# EAGLE design Joy2PS2 (EAGLE 7.7.0)
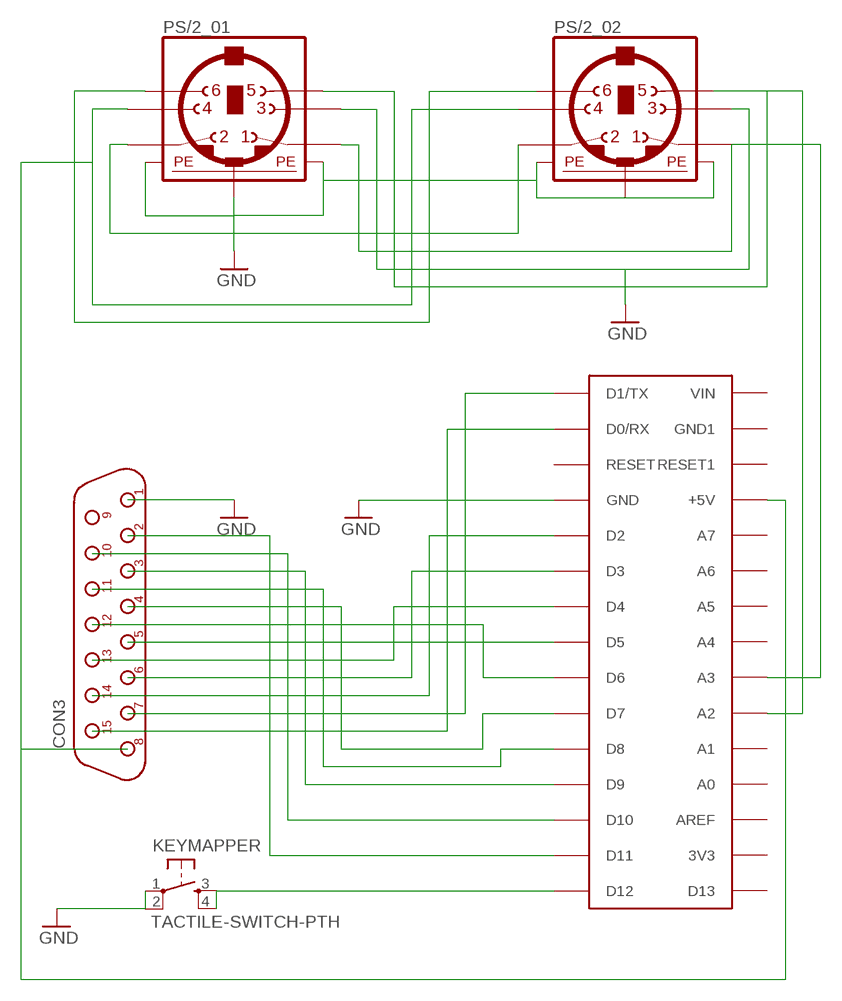
[diagram p0: schematic, sheet 1]

## Parts
ARDUINONANO  ARDUINONANO  [PDIP-32]
CON3  DB15F/90  [D-15F/90]
KEYMAPPER  TACTILE-SWITCH-PTH  [TAC-SWITCH-PTH]
PS/2_01  MINI_DIN_6  [M_DIN6]
PS/2_02  MINI_DIN_6  [M_DIN6]

## Nets
GND: ARDUINONANO.GND CON3.1 KEYMAPPER.1 KEYMAPPER.2 PS/2_01.3 PS/2_01.SH1(PE1) PS/2_01.SH2(PE2) PS/2_01.SH3(PE3) PS/2_02.3 PS/2_02.SH1(PE1) PS/2_02.SH2(PE2) PS/2_02.SH3(PE3)
N$1: ARDUINONANO.A3 PS/2_01.1 PS/2_02.1
N$2: PS/2_01.2 PS/2_02.2
N$3: ARDUINONANO.+5V CON3.8 PS/2_01.4 PS/2_02.4
N$5: ARDUINONANO.A2 PS/2_01.5 PS/2_02.5
N$6: ARDUINONANO.D10 CON3.10
N$7: ARDUINONANO.D8 CON3.11
N$8: ARDUINONANO.D0/RX CON3.15
N$9: ARDUINONANO.D1/TX CON3.7
N$10: ARDUINONANO.D2 CON3.14
N$11: ARDUINONANO.D3 CON3.6
N$12: ARDUINONANO.D4 CON3.13
N$13: ARDUINONANO.D5 CON3.5
N$14: ARDUINONANO.D6 CON3.12
N$15: ARDUINONANO.D7 CON3.4
N$16: ARDUINONANO.D9 CON3.3
N$17: ARDUINONANO.D11 CON3.2
N$19: ARDUINONANO.D12 KEYMAPPER.3 KEYMAPPER.4
N$20: PS/2_01.6 PS/2_02.6
Unconnected: ARDUINONANO.3V3 ARDUINONANO.A0 ARDUINONANO.A1 ARDUINONANO.A4 ARDUINONANO.A5 ARDUINONANO.A6 ARDUINONANO.A7 ARDUINONANO.AREF ARDUINONANO.D13 ARDUINONANO.GND1 ARDUINONANO.RESET ARDUINONANO.RESET1 ARDUINONANO.VIN CON3.9

## Library data of the parts
ARDUINONANO = jet-lib2:ARDUINONANO
CON3 = connect:DB15F/90
KEYMAPPER = GeekAmmo:TACTILE-SWITCH: Tactile Switch 4 Pins, SPST NO
PS/2_01 PS/2_02 = mini_din:MINI_DIN_6

## Board
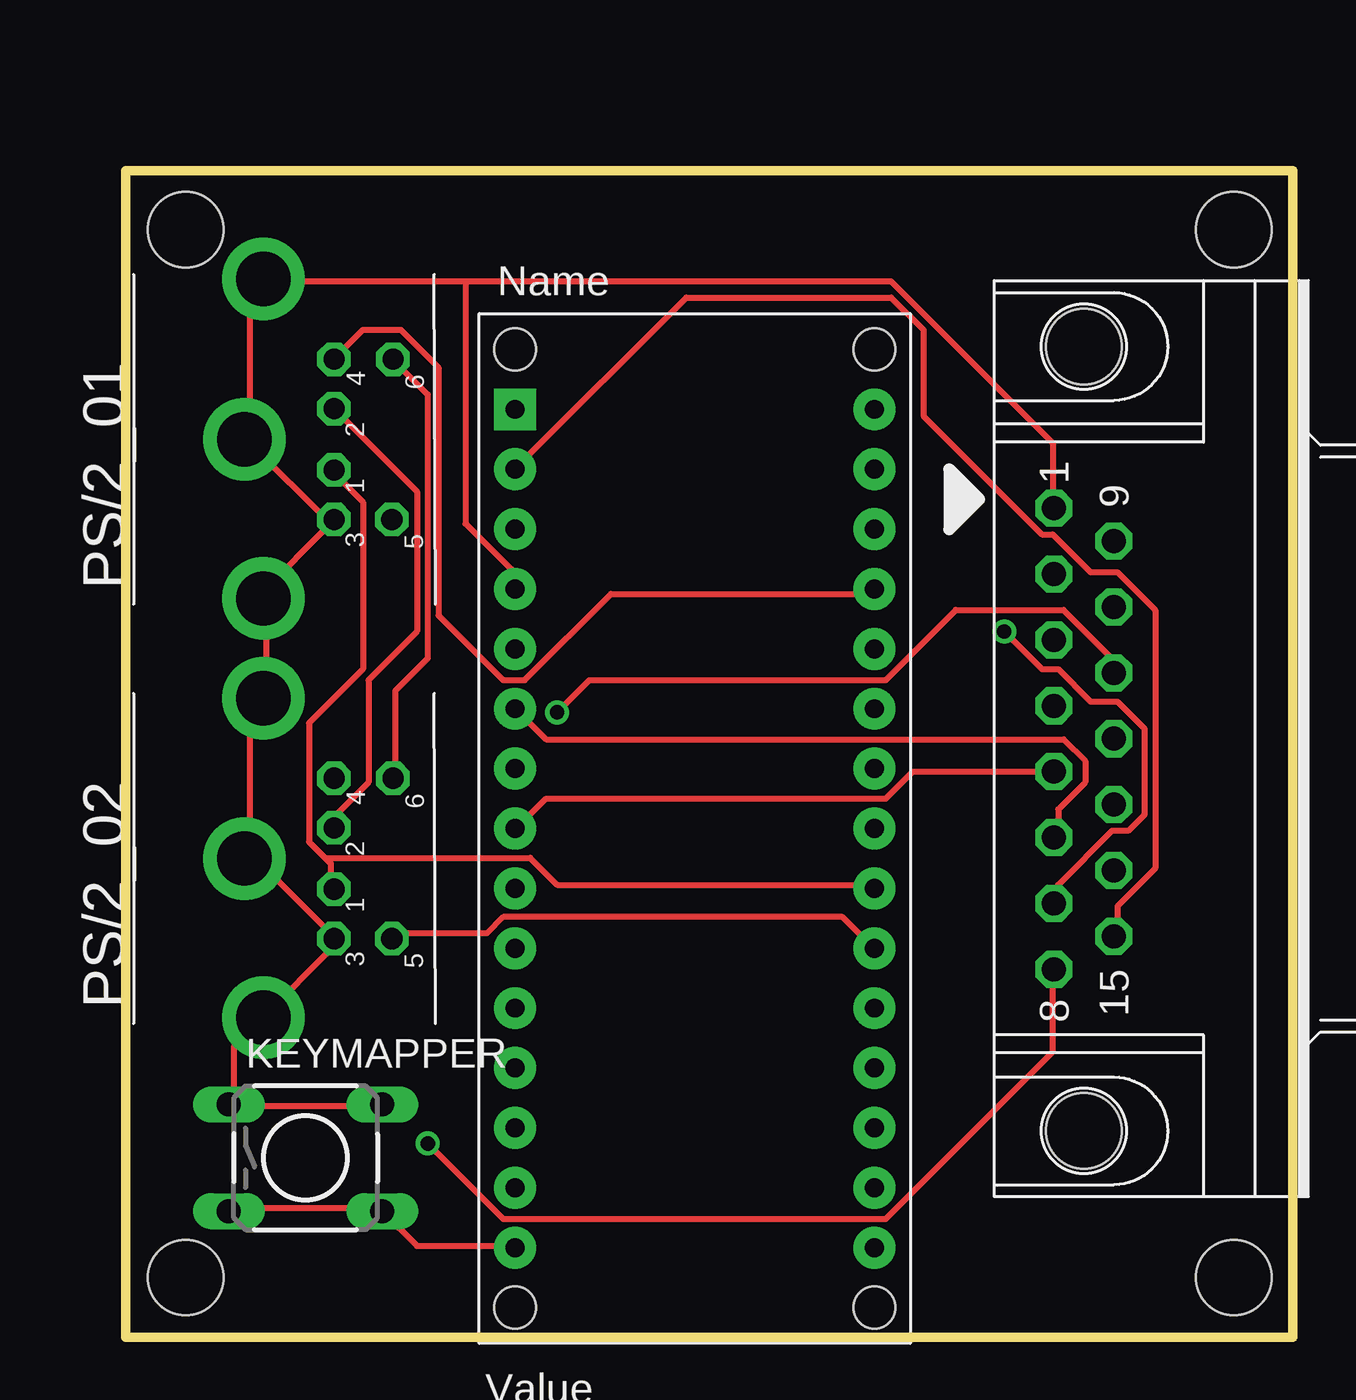
[diagram p1: board, top side]
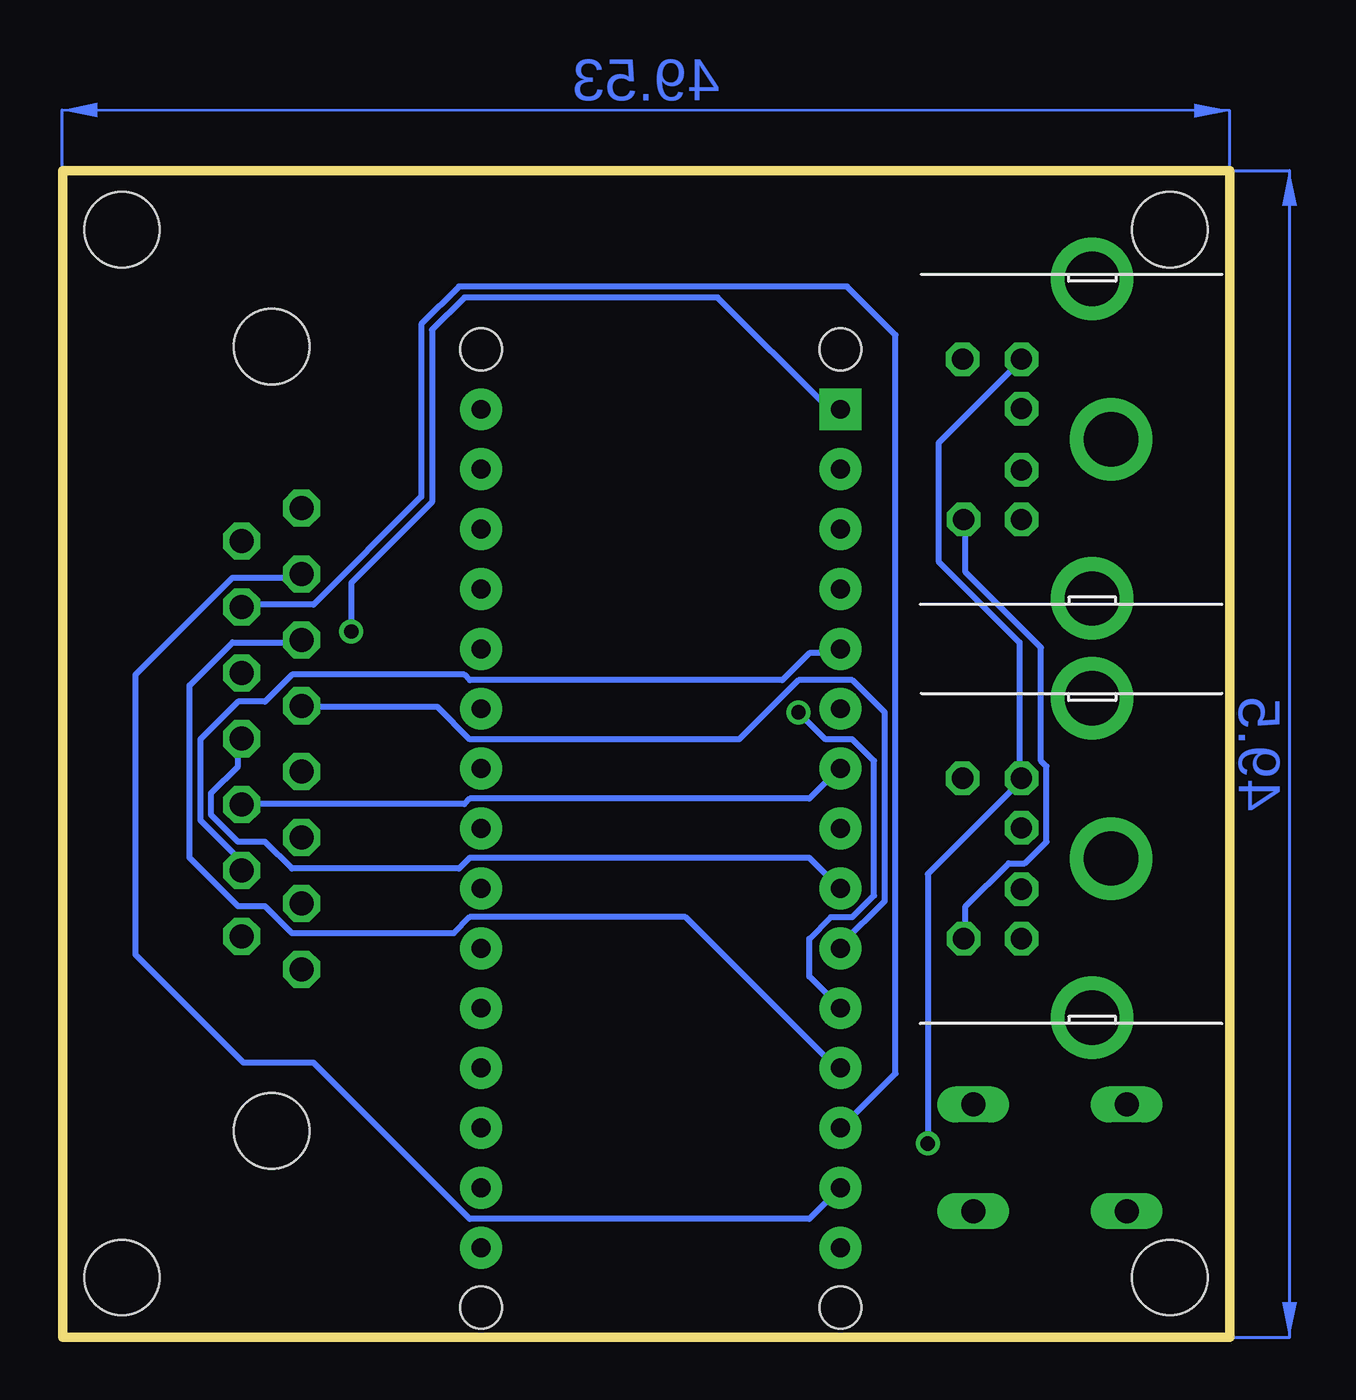
[diagram p2: board, bottom side, seen from below]

Size 49.5 x 49.5 mm. Coordinates in mm from the lower left corner, seen from the top.
Outline: 0,0 49.5,0 49.5,49.5 0,49.5 0,0
Copper layers (1*16): Top 0.035mm / dielectric 1.5mm / Bottom 0.035mm
Design rules "default": minimum track width 10mil, minimum drill 24mil, track to track 8mil, track to pad 8mil, pad to pad 8mil, via to via 8mil, smd to smd 8mil, copper to edge 40mil, drill to drill 8mil, minimum pad ring 10mil, minimum via ring 8mil, stop-mask expansion 4mil, vias tented up to drill 0mil, thermal gap 10mil
Holes 3.2 mm at 46.99,46.99 46.99,2.54 2.54,46.99 2.54,2.54

### Footprints (pad centres in the part's own frame; a part is rotated, then mirrored left to right if it is on the bottom)
PDIP-32 = drill 0.8 pad 1.778: 3V3 15.24,-35.56; +5V 15.24,-10.16; A0 15.24,-30.48; A1 15.24,-27.94; A2 15.24,-25.4; A3 15.24,-22.86; A4 15.24,-20.32; A5 15.24,-17.78; A6 15.24,-15.24; A7 15.24,-12.7; AREF 15.24,-33.02; D0/RX 0,-5.08; D2 0,-12.7; D3 0,-15.24; D4 0,-17.78; D5 0,-20.32; D6 0,-22.86; D7 0,-25.4; D8 0,-27.94; D9 0,-30.48; D10 0,-33.02; D11 0,-35.56; D12 0,-38.1; D13 15.24,-38.1; GND 0,-10.16; GND1 15.24,-5.08; RESET 0,-7.62; RESET1 15.24,-7.62; VIN 15.24,-2.54 | drill 0.8 pad 1.778 square: D1/TX 0,-2.54 | hole 1.778: 0,0; 0,-40.64; 15.24,-40.64; 15.24,0
D-15F/90 = drill 1.016 pad 1.575 octagon: 1 -9.779,-1.27; 2 -6.985,-1.27; 3 -4.191,-1.27; 4 -1.397,-1.27; 5 1.397,-1.27; 6 4.191,-1.27; 7 6.985,-1.27; 8 9.779,-1.27; 9 -8.382,1.27; 10 -5.588,1.27; 11 -2.794,1.27; 12 0,1.27; 13 2.794,1.27; 14 5.588,1.27; 15 8.382,1.27 | hole 3.2: 16.637,0; -16.637,0
TAC-SWITCH-PTH = drill 1.016 pad 1.524 long: 1 -3.251,2.261; 2 3.251,2.261; 3 -3.251,-2.261; 4 3.251,-2.261
M_DIN6 = drill 0.9 pad 1.422 octagon: 1 -1.3,-3.75; 2 1.3,-3.75; 3 -3.4,-3.75; 4 3.4,-3.75; 5 -3.4,-6.2; 6 3.4,-6.25 | drill 2.3 pad 3.5: SH1 6.8,-0.75; SH2 0,0.05; SH3 -6.75,-0.75

### Placement (x,y rotation side)
ARDUINONANO  16.51,41.91 0 top
CON3  40.64,25.4 270 top
KEYMAPPER  7.62,7.62 0 top
PS/2_01  5.08,38.1 90 top
PS/2_02  5.08,20.32 90 top

### Tracks (layer width: path | path; a pad name or v marks a point on that pad's centre or on a via)
GND
  Top 0.254: KEYMAPPER.2 10.74,9.83 4.57,9.83 KEYMAPPER.1 4.57,10.06 4.57,12.34 5.71,13.49 PS/2_02.SH3 5.94,13.72 8.69,16.46 8.69,16.92 PS/2_02.3 8.69,17.14 5.71,20.12 5.26,20.12 PS/2_02.SH2 5.26,20.34 5.26,26.52 5.71,26.98 PS/2_02.SH1 5.94,27.2 5.94,31.32 PS/2_01.SH3 5.71,31.55 8.69,34.52 | 8.69,34.52 5.26,37.95 PS/2_01.SH2 5.26,38.18 5.26,44.35 5.71,44.81 PS/2_01.SH1 5.94,44.81 14.4,44.81 | 8.69,34.52 PS/2_01.3 | 14.4,44.81 32.46,44.81 39.32,37.95 39.32,35.2 CON3.1 | 14.4,44.81 14.4,34.52 16.46,32.46 16.46,31.77 ARDUINONANO.GND
N$1
  Top 0.254: 8.46,20.34 7.77,21.03 7.77,26.06 10.06,28.35 10.06,35.43 8.91,36.58 PS/2_01.1 | 8.46,20.34 8.69,20.12 8.69,19.2 PS/2_02.1 | 8.46,20.34 17.14,20.34 18.29,19.2 31.55,19.2 ARDUINONANO.A3
N$2
  Top 0.254: PS/2_02.2 8.91,21.72 8.91,22.17 10.29,23.55 10.29,27.89 12.34,29.95 12.34,35.89 8.91,39.32 PS/2_01.2
N$3  (via drill 0.61)
  Top 0.254: v12.8,8.23 16,5.03 32.23,5.03 39.32,12.12 39.32,15.54 CON3.8 | ARDUINONANO.+5V 31.55,31.55 20.57,31.55 16.92,27.89 16,27.89 13.26,30.63 13.26,41.15 11.66,42.75 10.06,42.75 8.91,41.6 PS/2_01.4
  Bottom 0.254: PS/2_01.4 8.91,41.38 12.34,37.95 12.34,32.92 8.91,29.49 8.91,23.77 PS/2_02.4 8.91,23.55 12.8,19.66 v12.8,8.23
N$5
  Top 0.254: PS/2_02.5 11.43,17.14 15.32,17.14 16,17.83 30.4,17.83 31.55,16.69 ARDUINONANO.A2
  Bottom 0.254: PS/2_01.5 11.2,34.52 11.2,32.46 8,29.26 8,24.46 7.77,24.23 7.77,21.03 8.69,20.12 9.37,20.12 11.2,18.29 11.2,17.14 PS/2_02.5
N$6
  Bottom 0.254: CON3.10 41.83,31.09 38.86,31.09 34.29,35.66 34.29,42.98 32.69,44.58 16.23,44.58 14.17,42.52 14.17,11.2 16.46,8.91 ARDUINONANO.D10
N$7  (via drill 0.61)
  Top 0.254: v18.29,26.52 19.66,27.89 32.23,27.89 35.2,30.86 39.78,30.86 41.83,28.8 41.83,28.35 CON3.11
  Bottom 0.254: v18.29,26.52 17.14,25.38 16,25.38 15.09,24.46 15.09,18.75 16,17.83 16.92,17.83 17.83,16.92 17.83,15.32 16.69,14.17 ARDUINONANO.D8
N$8
  Top 0.254: CON3.15 42.06,17.14 42.06,18.29 43.66,19.89 43.66,30.86 42.06,32.46 40.92,32.46 39.32,34.06 38.86,34.06 33.83,39.09 33.83,42.75 32.46,44.12 23.77,44.12 16.69,37.03 ARDUINONANO.D0/RX
N$9  (via drill 0.61)
  Top 0.254: v37.26,29.95 38.86,28.35 39.55,28.35 40.92,26.98 42.06,26.98 43.2,25.83 43.2,22.17 42.52,21.49 41.83,21.49 39.55,19.2 39.55,18.52 CON3.7
  Bottom 0.254: v37.26,29.95 37.26,32 33.83,35.43 33.83,42.75 32.46,44.12 21.72,44.12 17.14,39.55 16.69,39.55 ARDUINONANO.D1/TX
N$10
  Bottom 0.254: CON3.14 42.06,19.89 42.06,20.34 43.66,21.95 43.66,25.38 42.06,26.98 40.92,26.98 39.78,28.12 32.46,28.12 32.23,27.89 18.97,27.89 17.83,29.03 16.69,29.03 ARDUINONANO.D2
N$11
  Top 0.254: CON3.6 39.55,21.26 39.55,22.4 40.69,23.55 40.69,24.46 39.78,25.38 17.83,25.38 16.69,26.52 ARDUINONANO.D3
N$12
  Bottom 0.254: CON3.13 41.83,22.63 32.46,22.63 32.23,22.86 17.83,22.86 16.69,24 ARDUINONANO.D4
N$13
  Top 0.254: CON3.5 33.38,24 32.23,22.86 17.83,22.86 16.69,21.72 ARDUINONANO.D5
N$14
  Bottom 0.254: CON3.12 42.06,25.38 42.06,24.23 43.2,23.09 43.2,22.17 42.06,21.03 40.92,21.03 39.78,19.89 32.69,19.89 32.23,20.34 17.83,20.34 16.69,19.2 ARDUINONANO.D6
N$15
  Bottom 0.254: CON3.4 39.32,26.75 33.6,26.75 32.23,25.38 20.8,25.38 18.29,27.89 16,27.89 14.63,26.52 14.63,18.52 16.46,16.69 ARDUINONANO.D7
N$16
  Bottom 0.254: CON3.3 39.55,29.49 42.29,29.49 44.12,27.66 44.12,20.34 42.06,18.29 40.92,18.29 39.78,17.14 32.92,17.14 32.23,17.83 23.09,17.83 16.69,11.43 ARDUINONANO.D9
N$17
  Bottom 0.254: ARDUINONANO.D11 17.83,5.03 32.23,5.03 38.86,11.66 41.83,11.66 46.41,16.23 46.41,28.12 42.29,32.23 39.55,32.23 CON3.2
N$19
  Top 0.254: KEYMAPPER.3 4.57,5.49 10.74,5.49 KEYMAPPER.4 12.34,3.89 16.46,3.89 ARDUINONANO.D12
N$20
  Top 0.254: PS/2_02.6 11.43,23.77 11.43,27.43 12.8,28.8 12.8,40.01 11.43,41.38 PS/2_01.6
(copper drawn outside any net)
  shapes: Bottom area x2